# EAGLE design RB02 (EAGLE 6.3)
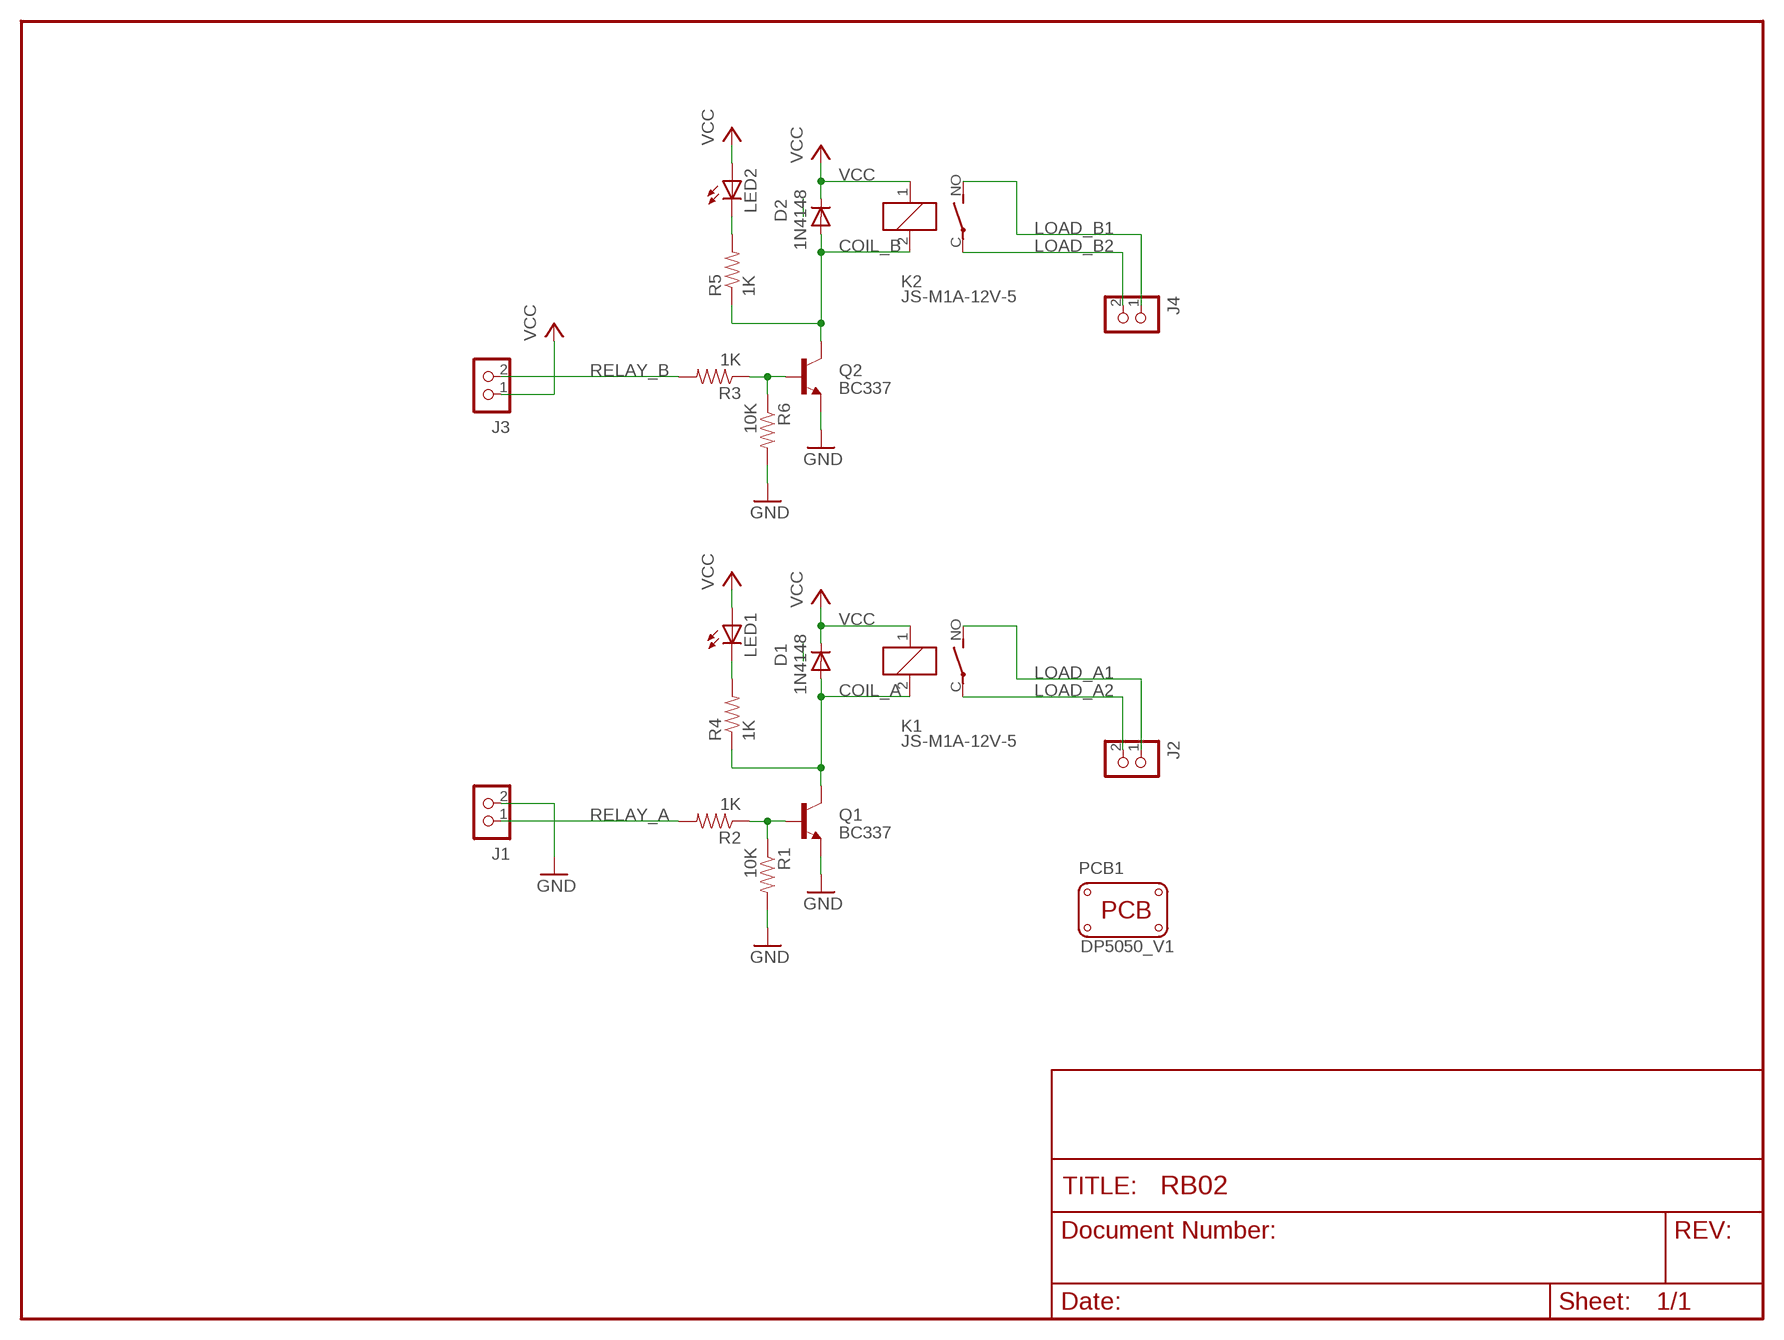
[diagram p0: schematic, sheet 1]

## Parts
D1  1N4148  DIODE1N4148  [DIODE-1N4148]
D2  1N4148  DIODE1N4148  [DIODE-1N4148]
J1  CON_TERMINAL_BLOCK_02-5MM  [TERMINAL_BLOCK_2P_5]
J2  CON_TERMINAL_BLOCK_02-5MM  [TERMINAL_BLOCK_2P_5]
J3  CON_TERMINAL_BLOCK_02-5MM  [TERMINAL_BLOCK_2P_5]
J4  CON_TERMINAL_BLOCK_02-5MM  [TERMINAL_BLOCK_2P_5]
K1  JS-M1A-12V-5  [JS-M1A]
K2  JS-M1A-12V-5  [JS-M1A]
LED1  LED5MM  [LED5MM]
LED2  LED5MM  [LED5MM]
PCB1  PCB_DP_SQUARE-5X5  [DP5050_V1]
Q1  BC337  [TO92]
Q2  BC337  [TO92]
R1  10K  RESISTORAXIAL-0.3  [AXIAL-0.3]
R2  1K  RESISTORAXIAL-0.3  [AXIAL-0.3]
R3  1K  RESISTORAXIAL-0.3  [AXIAL-0.3]
R4  1K  RESISTORAXIAL-0.3  [AXIAL-0.3]
R5  1K  RESISTORAXIAL-0.3  [AXIAL-0.3]
R6  10K  RESISTORAXIAL-0.3  [AXIAL-0.3]

## Nets
COIL_A: D1.A K1.2 Q1.3(C) R4.P$1
COIL_B: D2.A K2.2 Q2.3(C) R5.P$1
GND: J1.2 Q1.1(E) Q2.1(E) R1.P$2 R6.P$2
LOAD_A1: J2.1 K1.NO(2:S)
LOAD_A2: J2.2 K1.C(2:P)
LOAD_B1: J4.1 K2.NO(2:S)
LOAD_B2: J4.2 K2.C(2:P)
N$1: Q2.2(B) R3.P$1 R6.P$1
N$2: LED2.K(C) R5.P$2
N$6: Q1.2(B) R1.P$1 R2.P$1
N$9: LED1.K(C) R4.P$2
RELAY_A: J1.1 R2.P$2
RELAY_B: J3.2 R3.P$2
VCC: D1.C D2.C J3.1 K1.1 K2.1 LED1.A LED2.A

## Library data of the parts
D1 D2 = SparkFun:DIODE: Diode These are standard reverse protection diodes and small signal diodes. SMA package can handle up to about 1A. SOD-323 can handle about 200mA. What the SOD-323 package when ordering, there are some mfgs out there that are 5-pin packages.
J1-J4 = dp_devices:CON_TERMINAL_BLOCK_02: 2 poles wire to board terminal block
K1 K2 = relay:JS-M1A*: Automotive Ultra-Miniature Power Relay NAiS Source: http://www.mew-europe.com/.. en_ds_61211_0000.pdf; MPN: JSM1A-12V-5; OC_FARNELL: unknown; OC_NEWARK: 13P4555
LED1 LED2 = SparkFun:LED: LEDs Standard schematic elements and footprints for 5mm, 3mm, 1206, and 0603 sized LEDs. 5mm - Spark Fun Electronics SKU : COM-00529 (and others)
PCB1 = dp_devices:PCB_DP_SQUARE: Dangerous Prototypes Standard Square PCB sizes; PCB_SIZE: DP5050_V1
Q1 Q2 = transistor:BC337: NPN TRANSISTOR
R1-R6 = SparkFun:RESISTOR: Resistor Basic schematic elements and footprints for 0603, 1206, and PTH resistors.

## Board
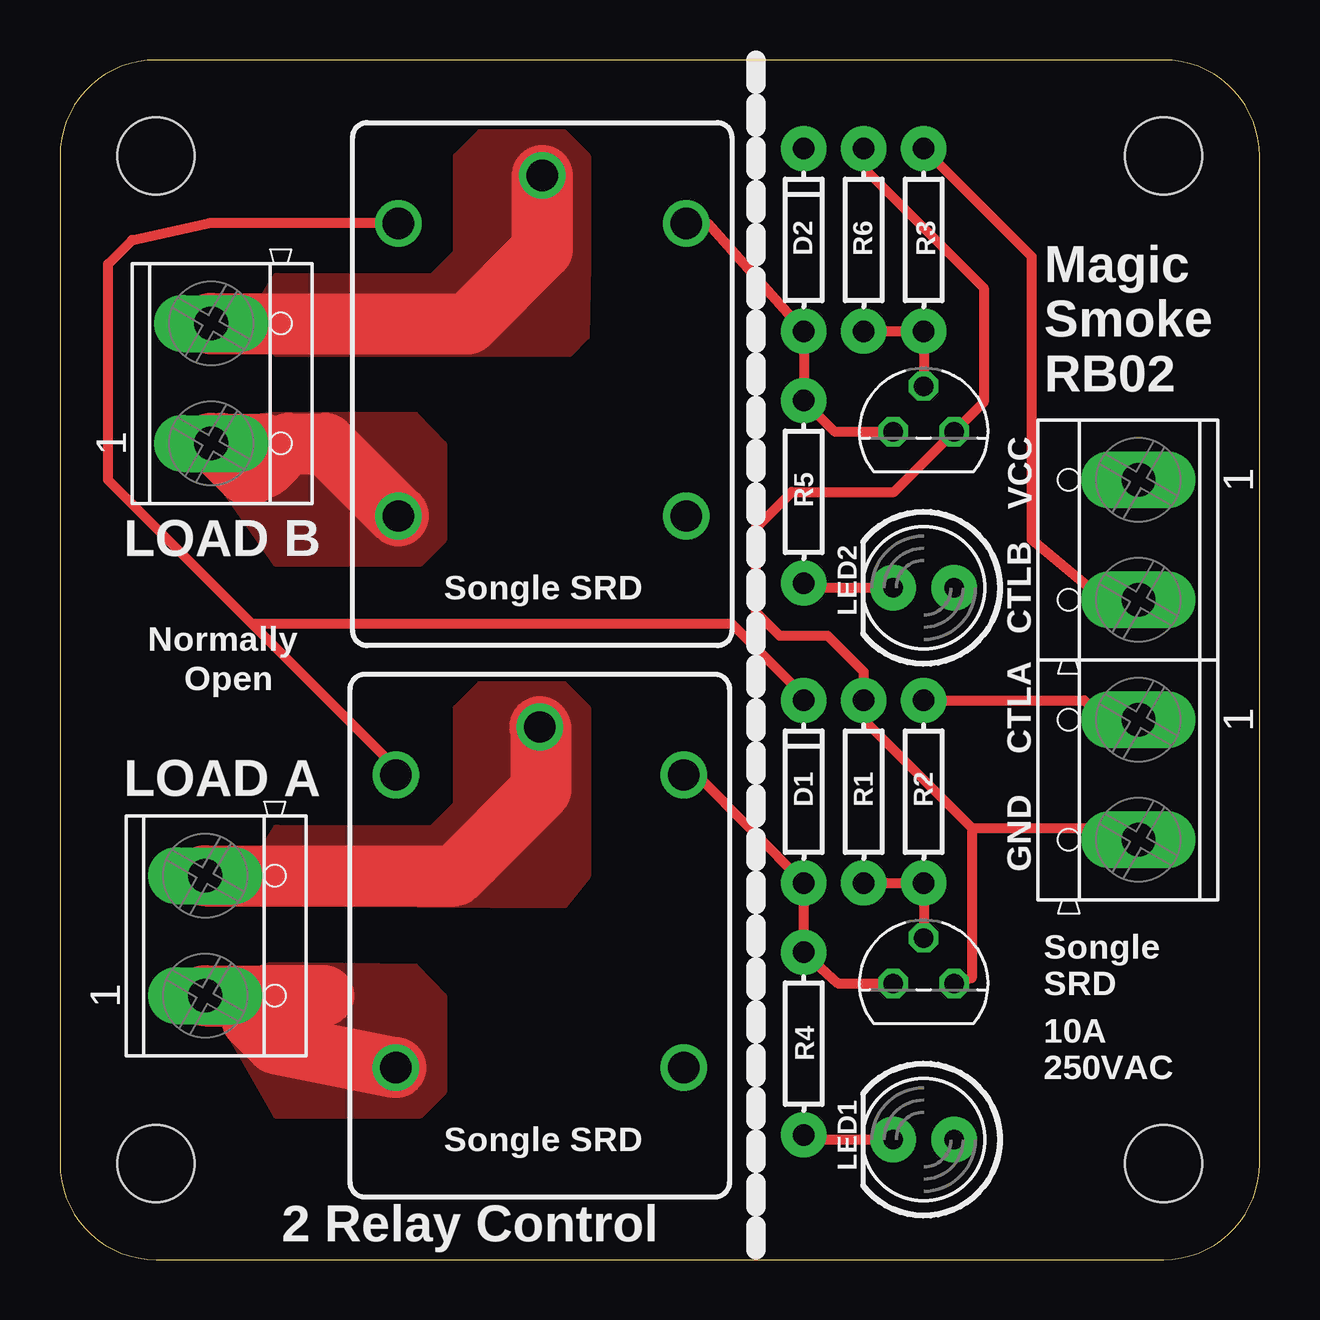
[diagram p1: board, top side]
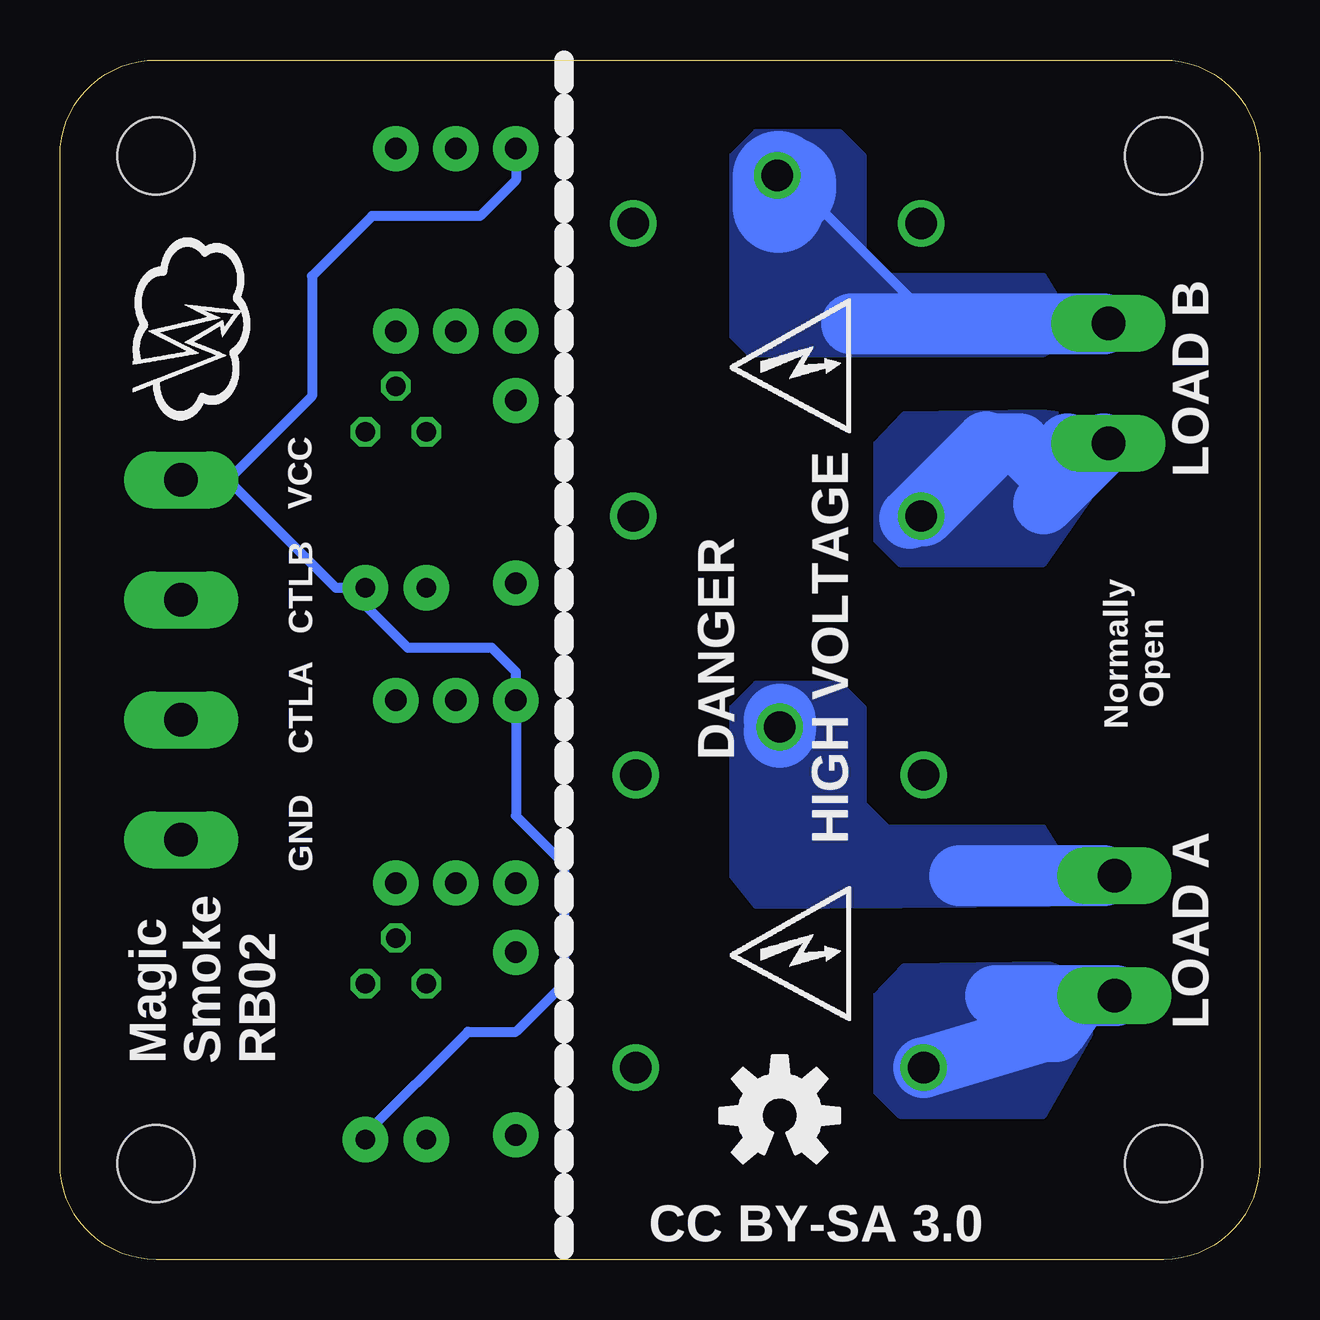
[diagram p2: board, bottom side, seen from below]

Size 50 x 50 mm. Coordinates in mm from the lower left corner, seen from the top.
Copper layers (1*2*15*16): Top 0.035mm / dielectric 0.2mm / Route2 0.0175mm / dielectric 1.1mm / Route15 0.0175mm / dielectric 0.2mm / Bottom 0.035mm
Design rules "SeeedStudio_DRU_no_angle_20130527": minimum track width 6mil, minimum drill 12mil, track to track 6mil, track to pad 6mil, pad to pad 6mil, via to via 6mil, smd to smd 0mil, copper to edge 10mil, drill to drill 10mil, minimum pad ring 6mil, minimum via ring 6mil, stop-mask expansion 2mil, vias tented up to drill 25mil, thermal gap 10mil

### Footprints (pad centres in the part's own frame; a part is rotated, then mirrored left to right if it is on the bottom)
DIODE-1N4148 = drill 0.9 pad 1.88: A -3.81,0; C 3.81,0
TERMINAL_BLOCK_2P_5 = drill 1.4 pad 2.38 long: 1 2.5,-0.45; 2 -2.5,-0.45
JS-M = drill 1.3: 1 6.7,6; 2 6.7,-6; C 8.7,0; NC -5.5,-6; NO -5.5,6
LED5MM = drill 0.813 pad 1.88: A -1.27,0; K 1.27,0
DP5050_V1 = hole 3.2: 4,4; 46,4; 46,46; 4,46
TO92 = drill 0.813 octagon: 1 1.27,0; 2 0,1.905; 3 -1.27,0
AXIAL-0.3 = drill 0.9 pad 1.88: P$1 -3.81,0; P$2 3.81,0

### Placement (x,y rotation side)
D1  31,19.5 90 top
D2  31,42.5 90 top
J1  44.5,20 90 top
J2  6.5,13.5 270 top
J3  44.5,30 90 top
J4  6.75,36.52 270 top
K1  JS-M1-12V-5  [JS-M]  20,13.5 90 top
K2  JS-M1-12V-5  [JS-M]  20.1,36.49 90 top
LED1  36,5 180 top
LED2  36,28 180 top
PCB1  0,0 0 top
Q1  36,11.5 0 top
Q2  36,34.5 0 top
R1  33.5,19.5 90 top
R2  36,19.5 90 top
R3  36,42.5 90 top
R4  31,9 270 top
R5  31,32 270 top
R6  33.5,42.5 90 top
U$2  [OSHW-LOGO-M]  20,6 0 bottom

### Tracks (layer width: path | path; a pad name or v marks a point on that pad's centre or on a via)
COIL_A
  Top 0.406: K1.2 26.56,20.2 D1.A R4.P$1 32.45,11.5 Q1.3
COIL_B
  Top 0.406: Q2.3 32.31,34.5 R5.P$1 D2.A 27,43.19 K2.2
GND
  Top 0.406: R6.P$2 33.5,45.5 38.5,40.5 38.5,35.73 Q2.1 34.77,32 30.5,32 29,30.5 29,27 30,26 32,26 33.5,24.5 R1.P$2 33.5,22.5 38,18 | 38,18 38,11.73 Q1.1 | 38,18 43,18 43.5,17.5 J1.2
LOAD_A1
  Top 2.54: J2.1 8.5,11 | 11,11 8.5,11 | 8.5,11 8,10.5 8,10 9,9 K1.NO
  Bottom 2.54: 6,11 11,11 7.5,11 8.5,9.5 9,9.5 K1.NO
  pour Top: 8.8,12.3 14.82,12.22 16,11 16,7 15,6 9,6 7,9.5 5.98,10.52 5.98,11.28
  pour Bottom: 8.8,12.3 14.82,12.22 16,11 16,7 15,6 9,6 5.98,11.28
LOAD_A2
  Top 2.54: J2.2 16.46,16 20.05,19.59 20.05,22.15 K1.C
  Bottom 2.54: 6.5,16 12.5,16
  Bottom 3: 20,22.5 20,22
  pour Top: 7.75,15.97 9,18 arc-60 9.1,18 15.5,18 16.5,19 16.5,23 17.5,24 21,24 22,23 22,16 21,14.75 8.76,14.83
  pour Bottom: 7.75,15.97 9,18 arc-60 9.1,18 15.5,18 16.5,19 16.5,23 17.5,24 21,24 22,23 22,16 21,14.75 8.76,14.83
LOAD_B1
  Top 2.54: J4.1 6.73,34.02 8,32.75 7.75,32.75 6.5,34 8.5,34 8.5,33 9.52,34.02 11.07,34.02 K2.NO
  Bottom 2.184: 14.08,31.08 11.41,34.08
  Bottom 2.54: 11.41,34.08 14.58,30.91 | 6.5,34 9,31.5 8,32.5 8,34 8.5,32 arc-60 8.5,32.5 10,34 11,34 14,31
  pour Bottom: 9.05,35.3 14.82,35.22 16,34 16,30 15,29 9,29 4.98,34.78
  pour Top: 9,35.23 14.82,35.22 16,34 16,30 15,29 9,29 4.98,34.78
LOAD_B2
  Top 2.54: K2.C 20.1,42.1 17,39 6.32,39 J4.2
  Bottom 0.406: 19.55,44.86 19.36,44.86 13.5,39 13,38.5
  Bottom 2.184: 20.08,44.53 19.99,45.03
  Bottom 2.54: 6.5,39 13,39 13.5,39 17,39
  Bottom 3.81: 20.05,45.13 20.05,43.86 | 19.55,44.63 19.55,44.86
  pour Bottom: 7.75,38.97 9,41 arc-60 9.1,41 15.5,41 16.5,42 16.5,46 17.5,47 21,47 22,46 22,38.5 21.25,37.75 9,37.75 8.5,38
  pour Top: 7.75,38.97 9,41 arc-60 9.1,41 15.5,41 16.5,42 16.5,46 17.5,47 21,47 22,46 22,41.5 21.95,38.45 21.25,37.75 9,37.75 9,38 8.76,37.83
N$1
  Top 0.406: R6.P$1 R3.P$1 Q2.2
N$2
  Top 0.406: LED2.K 31.31,28 R5.P$2
N$6
  Top 0.406: R1.P$1 R2.P$1 Q1.2
N$9
  Top 0.406: LED1.K 31.19,5 R4.P$2
RELAY_A
  Top 0.406: R2.P$2 42.69,23.31 43.5,22.5 J1.1
RELAY_B
  Top 0.406: J3.2 43.5,27.5 40.5,30 40.5,41.81 R3.P$2
VCC
  Top 0.406: D1.C 31,23.5 28,26.5 8,26.5 | 8,26.5 2,32.5 2,41.5 3,42.5 6.19,43.19 K2.1 | K1.1 14,20.5 8,26.5
  Bottom 0.406: LED1.A 37.33,5.17 33,9.5 31,9.5 29,11.5 29,16.5 31,18.5 D1.C 31,24.5 32,25.5 35.5,25.5 37.27,27.27 LED2.A 38.5,28 43,32.5 | 43,32.5 J3.1 | D2.C 31,45 32.5,43.5 37,43.5 39.5,41 39.5,36 43,32.5

### Text on the board
tPlace: Magic / Smoke / RB02 | VCC | LOAD B | Songle SRD | CTLB | Normally | Open | CTLA | LOAD A | GND | Songle / SRD | 10A / 250VAC | Songle SRD | 2 Relay Control
bPlace: LOAD B | VCC | Normally | Open | CTLB | DANGER | CTLA | LOAD A | HIGH VOLTAGE | GND | Magic / Smoke / RB02 | CC BY-SA 3.0 | /Users/thomasprice/Documents/eagle/logo/Magic_Smoke_logo.bmp